# Altium schematic sheet Super_Cap_Sch.SchDoc
size A4
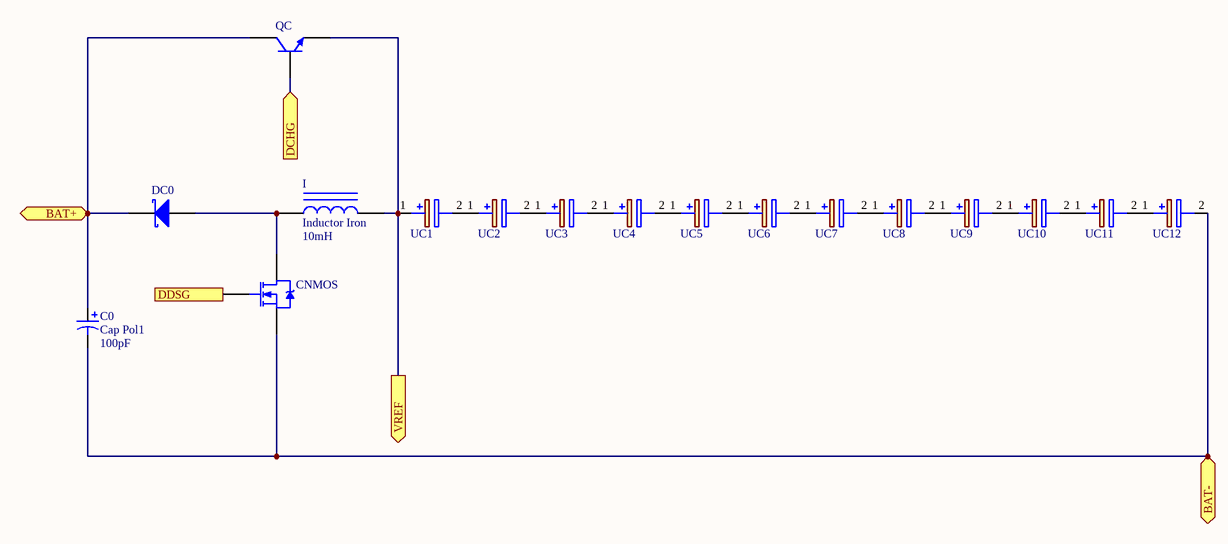
[diagram p0: Super_Cap_Sch.SchDoc]

## Parts
C0  Cap Pol1  value 100pF  [RB7.6-15]
CNMOS  NMOS-2  [TO-220AB]  (value not drawn)
DC0  Diode 10TQ035  [TO-220AC]  (value not drawn)
I  Inductor Iron  value 10mH  [AXIAL-0.9]
QC  NPN  [TO-226-AA]  (value not drawn)
UC1  MAL223051014E3  [CAPPRD500W60D1300H2200]  (value not drawn)
UC2  MAL223051014E3  [CAPPRD500W60D1300H2200]  (value not drawn)
UC3  MAL223051014E3  [CAPPRD500W60D1300H2200]  (value not drawn)
UC4  MAL223051014E3  [CAPPRD500W60D1300H2200]  (value not drawn)
UC5  MAL223051014E3  [CAPPRD500W60D1300H2200]  (value not drawn)
UC6  MAL223051014E3  [CAPPRD500W60D1300H2200]  (value not drawn)
UC7  MAL223051014E3  [CAPPRD500W60D1300H2200]  (value not drawn)
UC8  MAL223051014E3  [CAPPRD500W60D1300H2200]  (value not drawn)
UC9  MAL223051014E3  [CAPPRD500W60D1300H2200]  (value not drawn)
UC10  MAL223051014E3  [CAPPRD500W60D1300H2200]  (value not drawn)
UC11  MAL223051014E3  [CAPPRD500W60D1300H2200]  (value not drawn)
UC12  MAL223051014E3  [CAPPRD500W60D1300H2200]  (value not drawn)

## Ports
BAT+ (bidir), BAT- (bidir), DCHG (in), DDSG (in), VREF (out)

## Nets
BAT+: C0.1 DC0.1(K) QC.1(C) ; port BAT+
BAT-: C0.2 CNMOS.3(S) UC12.2(-) ; port BAT-
DCHG: QC.2(B) ; port DCHG
DDSG: CNMOS.1(G) ; port DDSG
VREF: I.2 QC.3(E) UC1.1(+) ; port VREF
NetCNMOS_2: CNMOS.2(D) DC0.3(A) I.1
NetUC1_2: UC1.2(-) UC2.1(+)
NetUC2_2: UC2.2(-) UC3.1(+)
NetUC3_2: UC3.2(-) UC4.1(+)
NetUC4_2: UC4.2(-) UC5.1(+)
NetUC5_2: UC5.2(-) UC6.1(+)
NetUC6_2: UC6.2(-) UC7.1(+)
NetUC7_2: UC7.2(-) UC8.1(+)
NetUC8_2: UC8.2(-) UC9.1(+)
NetUC9_2: UC9.2(-) UC10.1(+)
NetUC10_2: UC10.2(-) UC11.1(+)
NetUC11_2: UC11.2(-) UC12.1(+)

## Library data of the parts
C0 = Cap Pol1: Polarized Capacitor (Radial); Published: 8-Jun-2000; LatestRevisionDate: 17-Jul-2002; LatestRevisionNote: Re-released for DXP Platform.; PackageReference: RB7.6-15; Publisher: Altium Limited; PackageDescription: Polarized Capacitor (Radial); 2 Leads
CNMOS = NMOS-2: N-Channel Power MOSFET; Note: Pin 2 is electrically connected to pin 4.; Published: 8-Jun-2000; LatestRevisionDate: 17-Jul-2002; LatestRevisionNote: Re-released for DXP Platform.; DatasheetVersion: PD-9.814; PackageVersion: Feb-1997; PackageReference: TO-220AB; Publisher: Altium Limited; PackageDescription: TO, Thru-Hole, Vertical, Heatsink Mounted; 3 In-Line Leads; Pitch 2.54 mm; ComponentLink1Description: Manufacturer Link; ComponentLink1URL: http://www.irf.com/
DC0 = Diode 10TQ035: Schottky Rectifier; Note: Terminal 2 is the TAB and is electrically connected to the cathode; Published: 8-Jun-2000; LatestRevisionDate: 17-Jul-2002; LatestRevisionNote: Re-released for DXP Platform.; DatasheetVersion: PD-2.057B; PackageVersion: Feb-1998; PackageReference: TO-220AC; Publisher: Altium Limited; PackageDescription: TO, Thru-Hole, Vertical, Heatsink Mounted; 3 In-Line Leads (1 Absent); Pitch 2.54 mm; ComponentLink1Description: Manufacturer Link; ComponentLink1URL: http://www.irf.com/; ComponentLink2Description: Datasheet; ComponentLink2URL: http://www.irf.com/product-info/datasheets/data/10tq.pdf
I = Inductor Iron: Magnetic-Core Inductor; Published: 24-Mar-1999; LatestRevisionDate: 17-Jul-2002; LatestRevisionNote: Re-released for DXP Platform.; PackageReference: AXIAL-0.9; Publisher: Altium Limited; PackageDescription: Axial Device, Thru-Hole; 2 Leads; 0.9 in Pin Spacing
QC = NPN: NPN Bipolar Transistor; Published: 8-Jun-2000; LatestRevisionDate: 17-Jul-2002; LatestRevisionNote: Re-released for DXP Platform.; PackageReference: TO-226-AA; Publisher: Altium Limited; PackageDescription: TO, Flat Index; 3 In-Line, Axial Leads; Body Dia. 4.8mm; Leads 0.55 x 0.51 mm (max); Code_JEDEC: TO-226-AA
UC1-UC12 = MAL223051014E3: Capacitor Polarised; Manufacturer_Name: Vishay; Datasheet Link: https://www.mouser.de/datasheet/2/427/VISH_S_A0011831053_1-2572302.pdf; Height: 22mm; Manufacturer_Part_Number: MAL223051014E3; Mouser Part Number: 594-MAL223051014E3; Mouser Price/Stock: https://www.mouser.co.uk/ProductDetail/Vishay-BC-Components/MAL223051014E3?qs=vmHwEFxEFR9SM09FUoNIXg%3D%3D